# Altium schematic sheet Sheet_1_2026-06-06.schdoc
size 54 x 73 mm
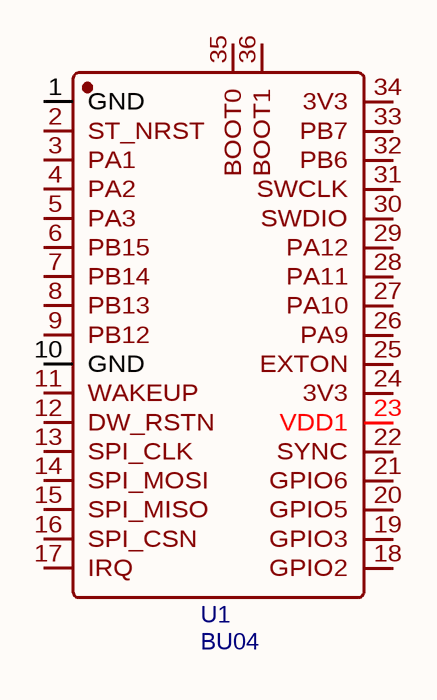
[diagram p0: Sheet_1_2026-06-06.schdoc]

## Parts
U1  BU04  [WIRELM-SMD_BU04]

## Nets

Not connected (* = marked no-connect by the designer): U1 1(GND) 2(ST_NRST) 3(PA1) 4(PA2) 5(PA3) 6(PB15) 7(PB14) 8(PB13) 9(PB12) 10(GND) 11(WAKEUP) 12(DW_RSTN) 13(SPI_CLK) 14(SPI_MOSI) 15(SPI_MISO) 16(SPI_CSN) 17(IRQ) 18(GPIO2) 19(GPIO3) 20(GPIO5) 21(GPIO6) 22(SYNC) 23(VDD1) 24(3V3) 25(EXTON) 26(PA9) 27(PA10) 28(PA11) 29(PA12) 30(SWDIO) 31(SWCLK) 32(PB6) 33(PB7) 34(3V3) 35(BOOT0) 36(BOOT1)

## Library data of the parts
U1 = BU04: Manufacturer: Ai-Thinker(安信可); Contributor: lcsc; Supplier: LCSC; Supplier Part: C42420050; Manufacturer Part: BU04; JLCPCB Part Class: Extended Part; spicePre: U; spiceSymbolName: BU04